# EAGLE design Projet Elec (EAGLE 7.7.0)
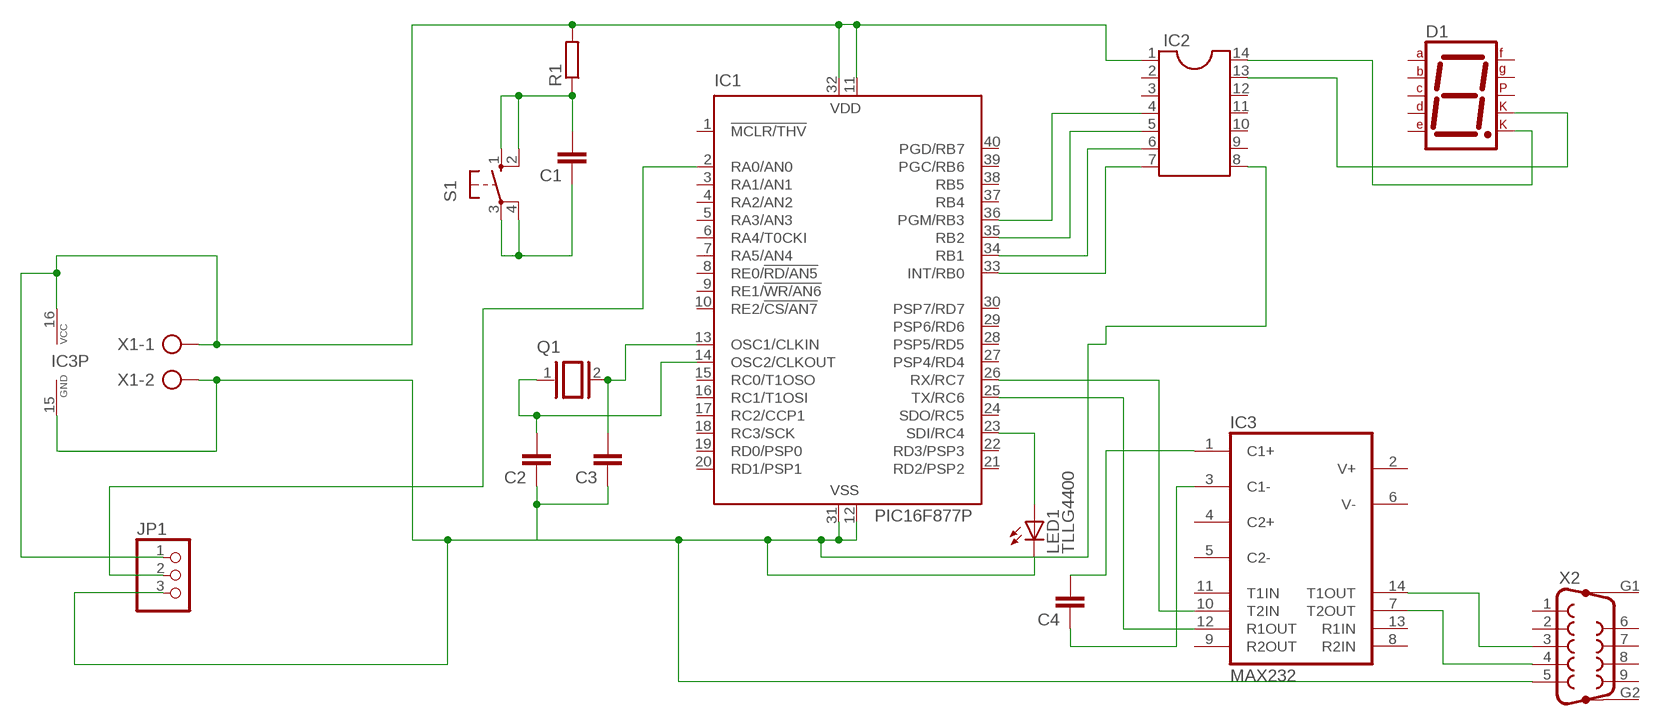
[diagram p0: schematic, sheet 1]

## Parts
C1  C-EU025-025X050  [C025-025X050]
C2  C-EU025-024X044  [C025-024X044]
C3  C-EU025-024X044  [C025-024X044]
C4  C-EU025-024X044  [C025-024X044]
D1  7SEG-CK  [7SEG-13]
IC1  PIC16F877P  [DIL40]
IC2  DIL14  [DIL14]
IC3  MAX232  [DIL16]
JP1  PINHD-1X3  [1X03]
LED1  TLLG4400  [LED3MM]
Q1  XTAL/S  [QS]
R1  R-EU_0207/10  [0207/10]
S1  10-XX  [B3F-10XX]
X1  AK300/2  [AK300/2]
X2  F09VP  [F09VP]

## Nets
N$1: IC1.11(VDD) IC1.32(VDD) IC2.1 IC3.16(VCC) JP1.1 R1.2 X1.1
N$2: C2.2 IC1.14(OSC2/CLKOUT) Q1.1
N$3: C2.1 C3.1 IC1.12(VSS) IC1.31(VSS) IC2.8 IC3.15(GND) JP1.3 LED1.K(C) X1.2 X2.5
N$4: C1.2 R1.1 S1.1(S) S1.2(S1)
N$5: C1.1 S1.3(P) S1.4(P1)
N$7: C3.2 IC1.13(OSC1/CLKIN) Q1.2
N$10: IC1.2(RA0/AN0) JP1.2
N$13: IC1.23(SDI/RC4) LED1.A
N$15: IC1.25(TX/RC6) IC3.12(R1OUT)
N$16: IC1.26(RX/RC7) IC3.10(T2IN)
N$17: IC1.33(INT/RB0) IC2.7
N$18: IC1.34(RB1) IC2.6
N$19: IC1.35(RB2) IC2.5
N$20: IC1.36(PGM/RB3) IC2.4
N$22: D1.3(CK1) IC2.13
N$23: D1.8(CK2) IC2.14
N$24: IC3.14(T1OUT) X2.3
N$25: IC3.7(T2OUT) X2.4
N$27: C4.2 IC3.1(C1+)
N$28: C4.1 IC3.3(C1-)
Unconnected: D1.1(E) D1.2(D) D1.4(C) D1.5(DP) D1.6(B) D1.7(A) D1.9(F) D1.10(G) IC1.1(!MCLR/THV) IC1.3(RA1/AN1) IC1.4(RA2/AN2) IC1.5(RA3/AN3) IC1.6(RA4/T0CKI) IC1.7(RA5/AN4) IC1.8(RE0/!RD/AN5) IC1.9(RE1/!WR/AN6) IC1.10(RE2/!CS/AN7) IC1.15(RC0/T1OSO) IC1.16(RC1/T1OSI) IC1.17(RC2/CCP1) IC1.18(RC3/SCK) IC1.19(RD0/PSP0) IC1.20(RD1/PSP1) IC1.21(RD2/PSP2) IC1.22(RD3/PSP3) IC1.24(SDO/RC5) IC1.27(PSP4/RD4) IC1.28(PSP5/RD5) IC1.29(PSP6/RD6) IC1.30(PSP7/RD7) IC1.37(RB4) IC1.38(RB5) IC1.39(PGC/RB6) IC1.40(PGD/RB7) IC2.2 IC2.3 IC2.9 IC2.10 IC2.11 IC2.12 IC3.2(V+) IC3.4(C2+) IC3.5(C2-) IC3.6(V-) IC3.8(R2IN) IC3.9(R2OUT) IC3.11(T1IN) IC3.13(R1IN) X2.1 X2.2 X2.6 X2.7 X2.8 X2.9 X2.G1 X2.G2

## Library data of the parts
C1-C4 = rcl:C-EU: CAPACITOR, European symbol
D1 = special:7SEG-CK: 7-segment DISPLAY single cathode, 13 mm
IC1 = microchip:PIC16F87*: MICROCONTROLLER; MF: MICROCHIP; MPN: PIC16F877-04/P; OC_FARNELL: 9761349; OC_NEWARK: 61K3463
IC2 = ic-package:DIL14: Dual In Line / Socket
IC3 = maxim:MAX232: RS232 TRANSCEIVER; MF: MAXIM; MPN: MAX232ACPE+; OC_FARNELL: 9723773; OC_NEWARK: 68K4544
JP1 = pinhead:PINHD-1X3: PIN HEADER
LED1 = led:TLLG4400: Low Current (2mA) LED 3 mm Tinted Diffused Package color GREEN Source: Data sheet <http://www.farnell.com/datasheets/391098.pdf>; MF: VISHAY SEMICONDUCTOR; OC_FARNELL: 1612435
Q1 = special:XTAL/S: CRYSTAL
R1 = rcl:R-EU_: RESISTOR, European symbol
S1 = switch-omron:10-XX: OMRON SWITCH; MPN: B3F-1000; OC_FARNELL: 176432; OC_NEWARK: 36M3542
X1 = con-ptr500:AK300/2: CONNECTOR; OC_FARNELL: unknown; OC_NEWARK: unknown
X2 = con-subd:F09VP: SUB-D; OC_FARNELL: unknown; OC_NEWARK: unknown

## Board
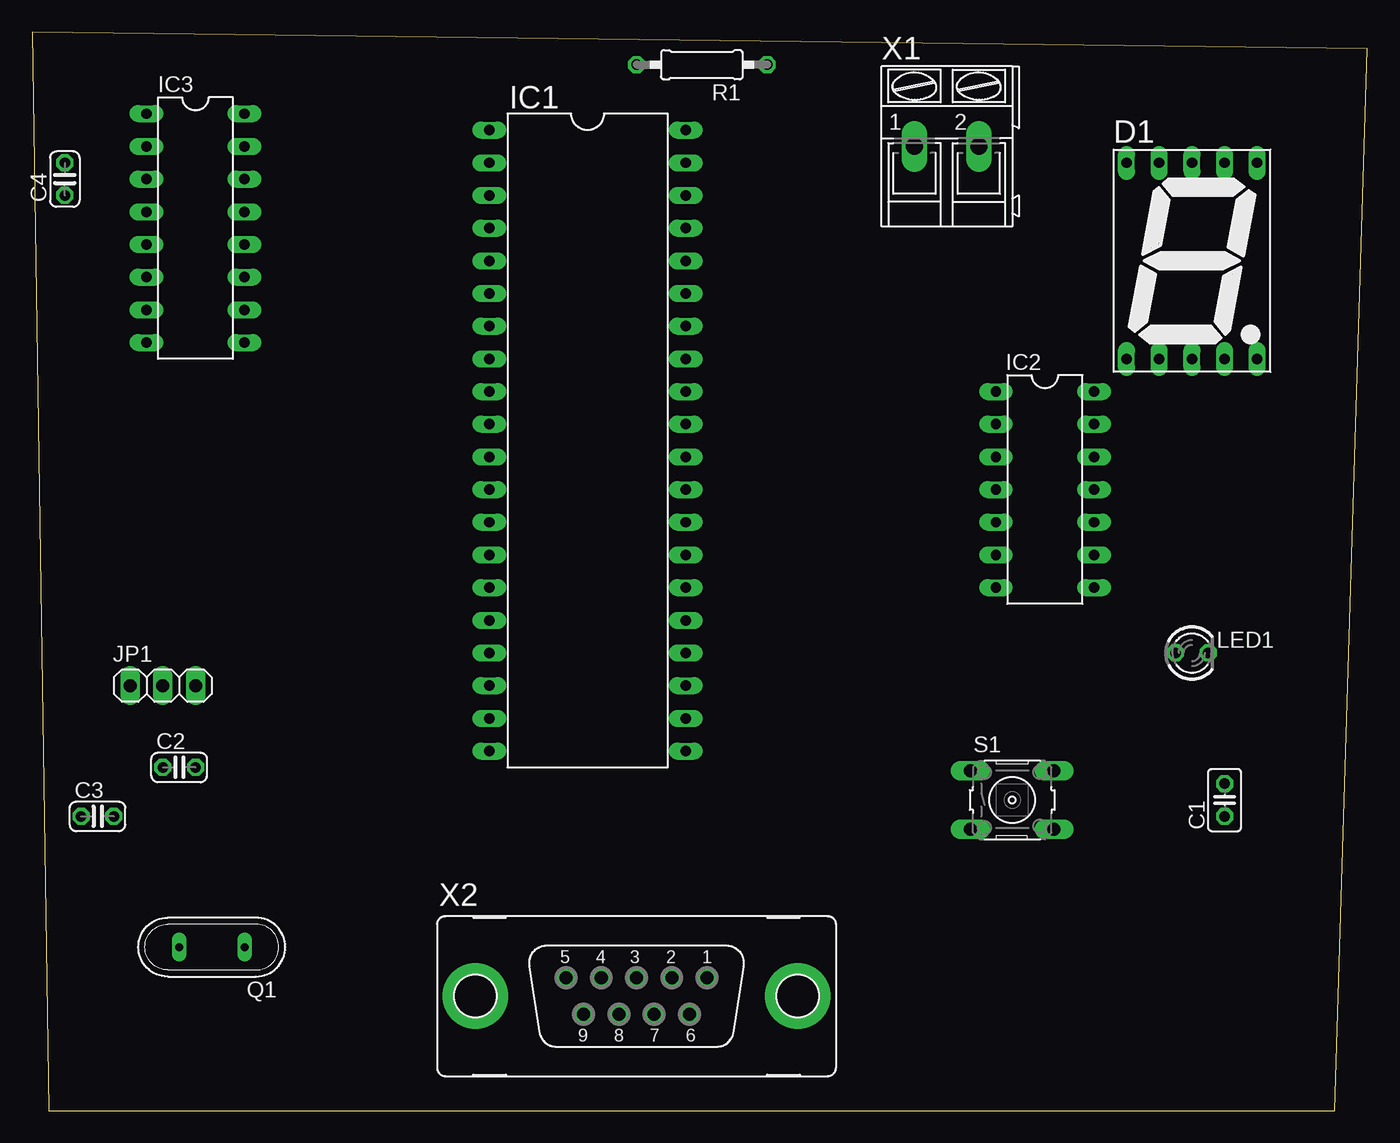
[diagram p1: board, top side]
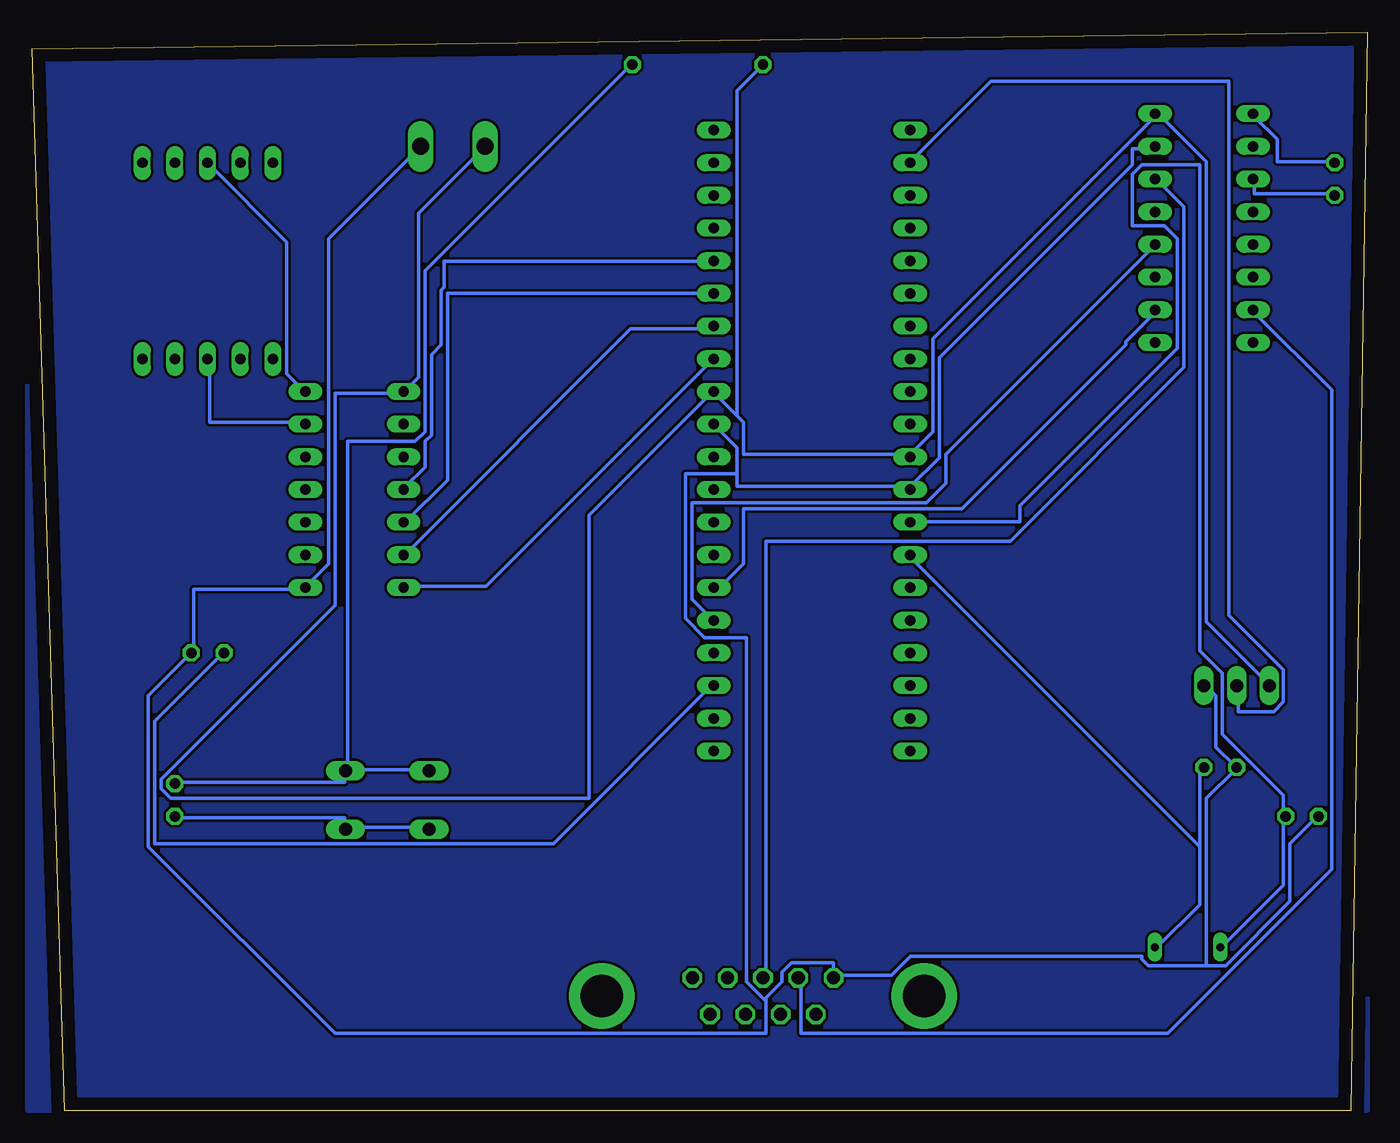
[diagram p2: board, bottom side, seen from below]

Size 103.81 x 83.81 mm. Coordinates in mm from the lower left corner, seen from the top.
Outline: 1.27,0 101.27,0 103.81,82.54 0,83.81 1.27,0
Copper layers (1*16): Top 0.035mm / dielectric 1.5mm / Bottom 0.035mm
Design rules "default": minimum track width 10mil, minimum drill 24mil, track to track 8mil, track to pad 8mil, pad to pad 8mil, via to via 8mil, smd to smd 8mil, copper to edge 40mil, drill to drill 8mil, minimum pad ring 10mil, minimum via ring 8mil, stop-mask expansion 4mil, vias tented up to drill 0mil, thermal gap 10mil

### Footprints (pad centres in the part's own frame; a part is rotated, then mirrored left to right if it is on the bottom)
C025-025X050 = drill 0.813 octagon: 1 -1.27,0; 2 1.27,0
C025-024X044 = drill 0.813 octagon: 1 -1.27,0; 2 1.27,0
7SEG-13 = drill 0.813 long: 1 -5.08,-7.62; 2 -2.54,-7.62; 3 0,-7.62; 4 2.54,-7.62; 5 5.08,-7.62; 6 5.08,7.62; 7 2.54,7.62; 8 0,7.62; 9 -2.54,7.62; 10 -5.08,7.62
DIL40 = drill 0.813 long: 1 -24.13,-7.62; 2 -21.59,-7.62; 3 -19.05,-7.62; 4 -16.51,-7.62; 5 -13.97,-7.62; 6 -11.43,-7.62; 7 -8.89,-7.62; 8 -6.35,-7.62; 9 -3.81,-7.62; 10 -1.27,-7.62; 11 1.27,-7.62; 12 3.81,-7.62; 13 6.35,-7.62; 14 8.89,-7.62; 15 11.43,-7.62; 16 13.97,-7.62; 17 16.51,-7.62; 18 19.05,-7.62; 19 21.59,-7.62; 20 24.13,-7.62; 21 24.13,7.62; 22 21.59,7.62; 23 19.05,7.62; 24 16.51,7.62; 25 13.97,7.62; 26 11.43,7.62; 27 8.89,7.62; 28 6.35,7.62; 29 3.81,7.62; 30 1.27,7.62; 31 -1.27,7.62; 32 -3.81,7.62; 33 -6.35,7.62; 34 -8.89,7.62; 35 -11.43,7.62; 36 -13.97,7.62; 37 -16.51,7.62; 38 -19.05,7.62; 39 -21.59,7.62; 40 -24.13,7.62
DIL14 = drill 0.813 long: 1 -7.62,-3.81; 2 -5.08,-3.81; 3 -2.54,-3.81; 4 0,-3.81; 5 2.54,-3.81; 6 5.08,-3.81; 7 7.62,-3.81; 8 7.62,3.81; 9 5.08,3.81; 10 2.54,3.81; 11 0,3.81; 12 -2.54,3.81; 13 -5.08,3.81; 14 -7.62,3.81
DIL16 = drill 0.813 long: 1 -8.89,-3.81; 2 -6.35,-3.81; 3 -3.81,-3.81; 4 -1.27,-3.81; 5 1.27,-3.81; 6 3.81,-3.81; 7 6.35,-3.81; 8 8.89,-3.81; 9 8.89,3.81; 10 6.35,3.81; 11 3.81,3.81; 12 1.27,3.81; 13 -1.27,3.81; 14 -3.81,3.81; 15 -6.35,3.81; 16 -8.89,3.81
1X03 = drill 1.016 long: 1 -2.54,0; 2 0,0; 3 2.54,0
LED3MM = drill 0.813 octagon: A -1.27,0; K 1.27,0
QS = drill 0.61 long: 1 -2.54,0; 2 2.54,0
0207/10 = drill 0.813 octagon: 1 -5.08,0; 2 5.08,0
B3F-10XX = drill 1.016 long: 1 -3.251,2.261; 2 3.251,2.261; 3 -3.251,-2.261; 4 3.251,-2.261
AK300/2 = drill 1.321 long: 1 -2.515,0; 2 2.489,0
F09VP = drill 1.016 octagon: 1 5.486,1.422; 2 2.743,1.422; 3 0,1.422; 4 -2.743,1.422; 5 -5.486,1.422; 6 4.115,-1.422; 7 1.372,-1.422; 8 -1.372,-1.422; 9 -4.115,-1.422 | drill 3.302 pad 5.08: G1 -12.522,0; G2 12.522,0

### Placement (x,y rotation side)
C1  92.71,24.13 90 top
C2  11.43,26.67 0 top
C3  5.08,22.86 0 top
C4  2.54,72.39 90 top
D1  90.17,66.04 0 top
IC1  43.18,52.07 270 top
IC2  78.74,48.26 270 top
IC3  12.7,68.58 270 top
JP1  10.16,33.02 0 top
LED1  90.17,35.56 0 top
Q1  13.97,12.7 180 top
R1  52.07,81.28 180 top
S1  76.2,24.13 0 top
X1  71.12,74.93 0 top
X2  46.99,8.89 0 top

### Tracks (layer width: path | path; a pad name or v marks a point on that pad's centre or on a via)
N$1
  Bottom 0.254: X1.1 68.77,74.75 73.77,69.75 73.77,57 74.77,56 IC2.1 75.02,55.75 80.27,55.75 80.27,39.25 93.77,25.75 93.77,25 93.02,24.25 60.52,24.25 60.52,46.25 51.02,55.75 IC1.32 50.77,55.75 49.02,54 | 49.02,54 48.52,53.5 48.52,51 35.77,51 IC1.11 35.52,51 33.77,52.75 33.77,60 16.52,77.25 IC3.16 16.27,77.5 12.52,73.75 12.52,38 7.77,33.25 JP1.1 | R1.2 49.02,79.25 49.02,54
N$2
  Bottom 0.254: 13.02,20.5 13.02,26.25 12.77,26.5 C2.2 | 13.02,20.5 13.02,16 16.27,12.75 Q1.1 | 13.02,20.5 35.52,43 IC1.14
N$3
  Bottom 0.254: 49.02,49.5 49.02,51.5 50.77,53.25 IC1.31 | 49.02,49.5 49.02,48.5 35.77,48.5 IC1.12 35.52,48.5 33.27,50.75 33.27,58.5 18.27,73.5 18.27,74.75 16.52,74.75 IC3.15 | X1.2 73.77,74.75 80.77,67.75 80.77,42.5 82.52,40.75 IC2.8 82.77,40.5 91.27,40.5 91.27,35.75 LED1.K 91.52,35.5 94.77,32.25 94.77,20.5 80.27,6 46.77,6 46.77,8.5 | 12.52,11.25 11.02,11.25 6.02,16.25 6.02,20.75 4.02,22.75 C3.1 | 12.52,11.25 12.52,24.25 10.27,26.5 C2.1 10.27,26.75 11.77,28.25 11.77,32.25 12.52,33 JP1.3 | 12.52,11.25 17.02,11.25 17.52,11.75 17.52,12 35.52,12 37.02,10.5 41.27,10.5 X2.5 41.52,10.5 41.52,11.5 44.77,11.5 45.52,10.75 45.52,10 46.77,8.75 46.77,8.5 | 49.02,49.5 53.02,49.5 53.02,38.25 51.52,36.75 48.27,36.75 48.27,10 46.77,8.5
N$4
  Bottom 0.254: 79.27,26.5 79.27,52 74.02,52 73.27,52.75 73.27,65.25 57.27,81.25 R1.1 | C1.2 92.52,25.5 79.52,25.5 79.52,26.25 S1.2 79.27,26.5 | 79.27,26.5 73.02,26.5 S1.1
N$5
  Bottom 0.254: C1.1 92.52,22.75 79.52,22.75 79.52,22 S1.4 79.27,22 73.02,22 S1.3
N$6
  pour Bottom: 0,83.82 1.27,83.82 1.27,0 101.6,0 104.14,0 104.14,82.55 1.27,82.55
N$7
  Bottom 0.254: Q1.2 11.27,12.75 6.52,17.5 6.52,22.75 C3.2 6.52,23 6.52,24.5 11.27,29.25 11.27,34 13.02,35.75 13.02,73.5 17.52,73.5 18.27,72.75 18.27,68.75 15.77,68.75 14.77,67.75 14.77,59.25 27.02,47 27.02,45.75 35.52,45.75 IC1.13
N$8
  pour Bottom (isolate 0.8): 0,83.82 0,0 104.14,0 104.14,82.55 0,82.55
N$10
  Bottom 0.254: IC1.2 35.52,73.75 29.27,80 10.77,80 10.77,38.5 6.52,34.25 6.52,31.75 7.27,31 10.02,31 10.02,33 JP1.2
N$13
  Bottom 0.254: IC1.23 51.02,33 63.27,20.75 94.27,20.75 94.27,30.25 89.02,35.5 LED1.A
N$15
  Bottom 0.254: IC3.12 16.52,67.25 32.77,51 32.77,48.75 34.27,47.25 52.52,47.25 52.52,39.75 51.02,38.25 IC1.25
N$16
  Bottom 0.254: IC3.10 16.52,62 18.77,59.75 18.77,59.5 31.52,46.75 48.52,46.75 48.52,42.5 50.27,40.75 50.77,40.75 IC1.26
N$17
  Bottom 0.254: IC1.33 51.02,58.25 68.52,40.75 74.77,40.75 IC2.7
N$18
  Bottom 0.254: IC2.6 74.77,43.25 57.27,60.75 51.02,60.75 IC1.34
N$19
  Bottom 0.254: IC1.35 71.52,63.5 71.52,49 74.77,45.75 IC2.5
N$20
  Bottom 0.254: IC1.36 51.02,66 71.77,66 71.77,64 72.02,63.75 72.02,59.5 72.77,58.75 72.77,52.5 73.27,52 73.27,50 74.77,48.5 IC2.4
N$22
  Bottom 0.254: IC2.13 82.77,53.5 90.02,53.5 90.02,58.25 D1.3
N$23
  Bottom 0.254: IC2.14 82.77,56 84.02,57.25 84.02,67.5 90.02,73.5 D1.8
N$24
  Bottom 0.254: IC3.14 16.27,72.25 14.27,70.25 14.27,57.75 27.77,44.25 46.77,44.25 46.77,10.5 X2.3
N$25
  Bottom 0.254: IC3.7 8.77,62 2.77,56 2.77,18.75 15.52,6 44.02,6 44.02,10.25 X2.4
N$27
  Bottom 0.254: C4.2 2.77,73.75 7.02,73.75 7.02,75.5 8.77,77.25 IC3.1
N$28
  Bottom 0.254: C4.1 2.77,71.25 8.77,71.25 8.77,72.25 IC3.3